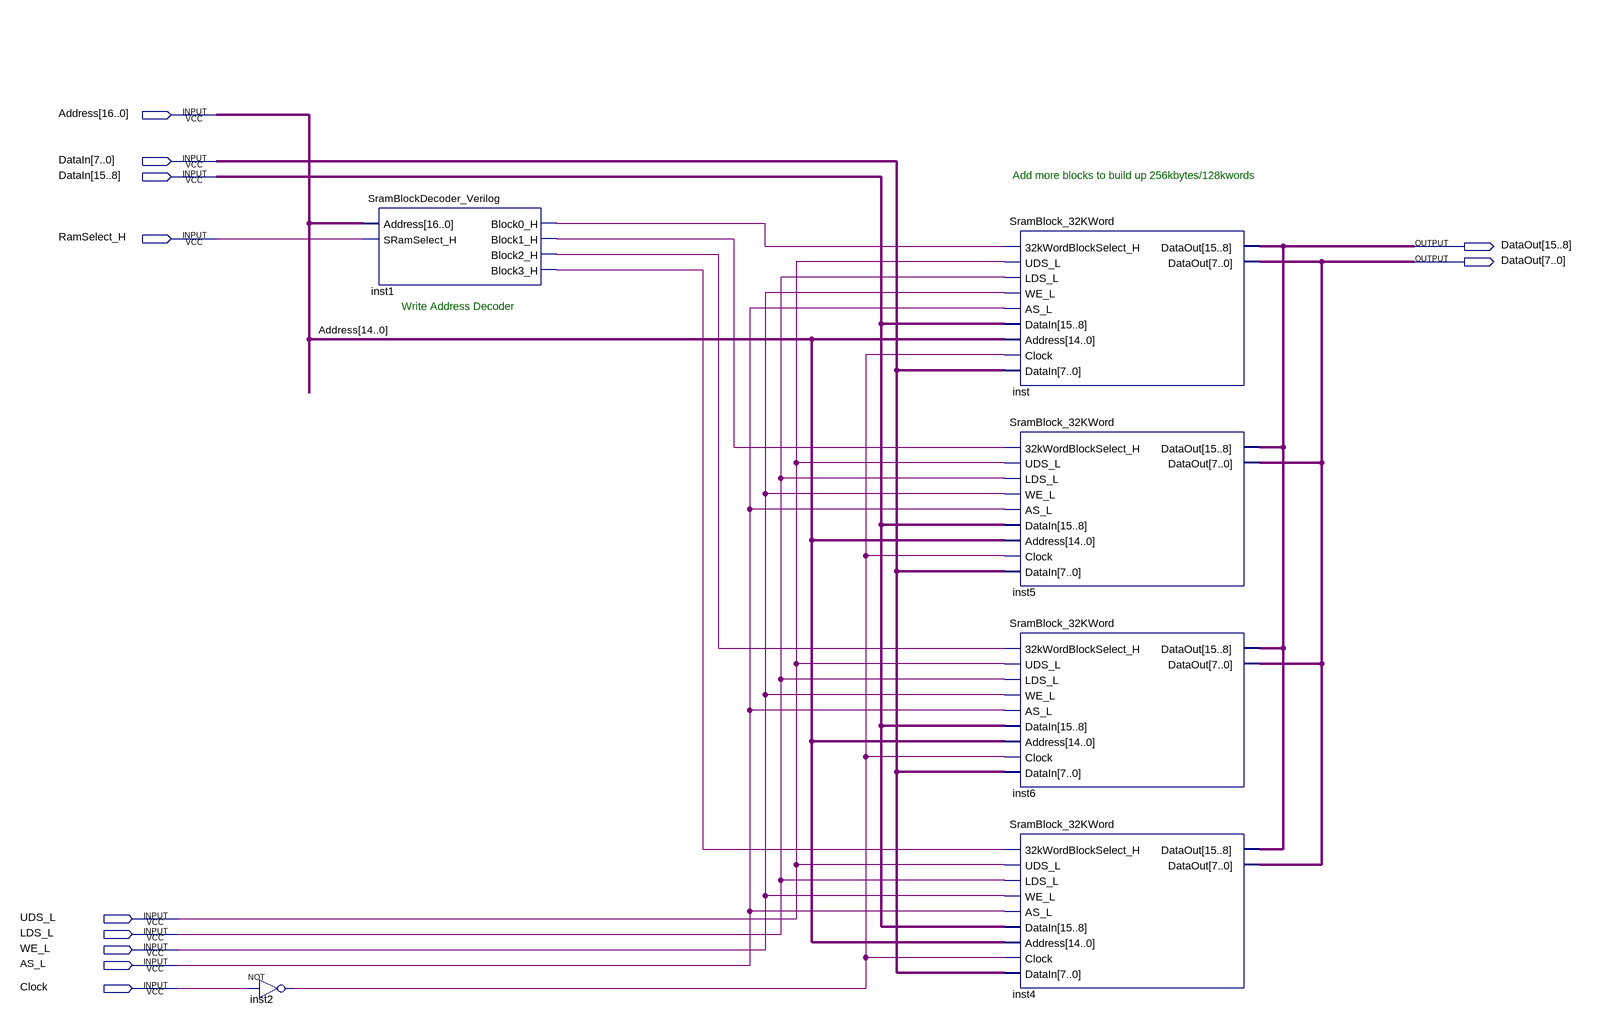
[diagram p0: schematic sheet]
// Quartus schematic OnChipRam256kbyte.bdf as structural Verilog: 6 symbols, 11 pins
module OnChipRam256kbyte (
  input  [16:0] Address,
  input  [15:0] DataIn,
  input  RamSelect_H,
  input  UDS_L,
  input  LDS_L,
  input  WE_L,
  input  AS_L,
  input  Clock,
  output [15:0] DataOut
);

  wire inst1_block0_h, inst1_block1_h, inst1_block2_h, inst1_block3_h, inst2_out;

  not inst2 (inst2_out, Clock);
  SramBlockDecoder_Verilog inst1 (
    .Address(Address), .SRamSelect_H(RamSelect_H), .Block0_H(inst1_block0_h), .Block1_H(inst1_block1_h),
    .Block2_H(inst1_block2_h), .Block3_H(inst1_block3_h));
  SramBlock_32KWord inst (
    .\32kWordBlockSelect_H (inst1_block0_h), .UDS_L(UDS_L), .LDS_L(LDS_L), .WE_L(WE_L), .AS_L(AS_L),
    .DataIn(DataIn), .Address(Address[14:0]), .Clock(inst2_out), .DataOut(DataOut));
  SramBlock_32KWord inst5 (
    .\32kWordBlockSelect_H (inst1_block1_h), .UDS_L(UDS_L), .LDS_L(LDS_L), .WE_L(WE_L), .AS_L(AS_L),
    .DataIn(DataIn), .Address(Address[14:0]), .Clock(inst2_out), .DataOut(DataOut));
  SramBlock_32KWord inst6 (
    .\32kWordBlockSelect_H (inst1_block2_h), .UDS_L(UDS_L), .LDS_L(LDS_L), .WE_L(WE_L), .AS_L(AS_L),
    .DataIn(DataIn), .Address(Address[14:0]), .Clock(inst2_out), .DataOut(DataOut));
  SramBlock_32KWord inst4 (
    .\32kWordBlockSelect_H (inst1_block3_h), .UDS_L(UDS_L), .LDS_L(LDS_L), .WE_L(WE_L), .AS_L(AS_L),
    .DataIn(DataIn), .Address(Address[14:0]), .Clock(inst2_out), .DataOut(DataOut));

  // Notes on the sheet:
  //   Add more blocks to build up 256kbytes/128kwords
  //   Write Address Decoder
endmodule
